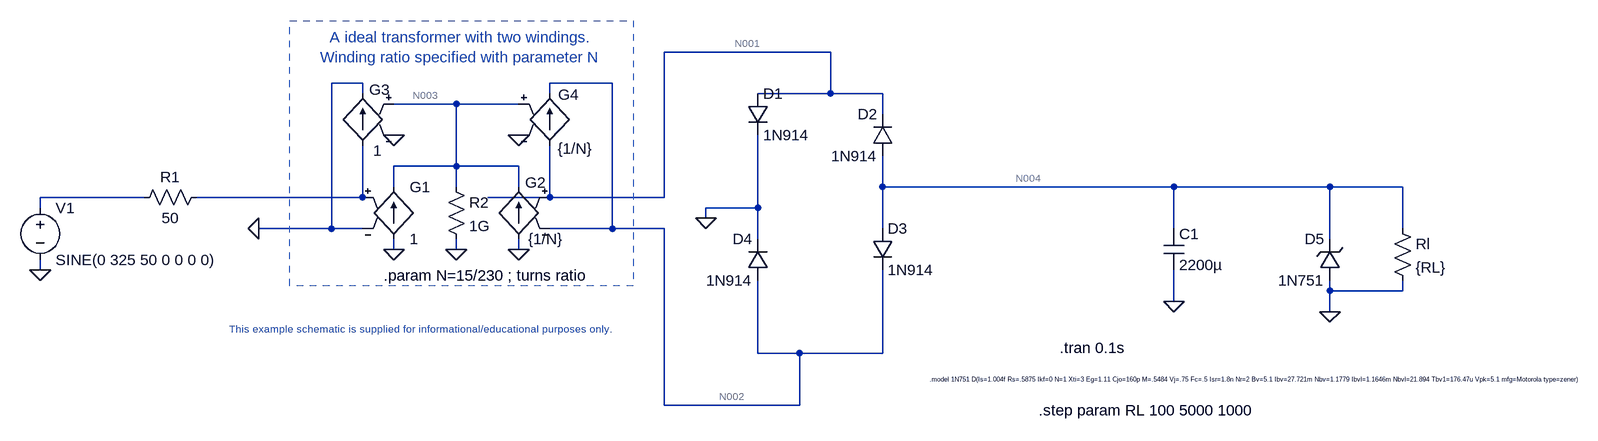
[diagram p0: schematic Voltage_Regulator_with_A_Shunt_capacitor.asc]
Voltage_Regulator_with_A_Shunt_capacitor.asc, the LTspice schematic file:
Version 4
SHEET 1 1868 680
WIRE 608 -192 352 -192
WIRE -112 -144 -160 -144
WIRE 272 -144 176 -144
WIRE -112 -128 -112 -144
WIRE 176 -128 176 -144
WIRE 608 -128 608 -192
WIRE 608 -128 496 -128
WIRE 688 -128 608 -128
WIRE 32 -112 -64 -112
WIRE 128 -112 32 -112
WIRE 688 -96 688 -128
WIRE 32 -16 32 -112
WIRE 32 -16 -64 -16
WIRE 128 -16 32 -16
WIRE -64 16 -64 -16
WIRE 32 16 32 -16
WIRE 128 16 128 -16
WIRE 688 16 688 -32
WIRE 1136 16 688 16
WIRE 1376 16 1136 16
WIRE 1488 16 1376 16
WIRE -448 32 -608 32
WIRE -112 32 -112 -48
WIRE -112 32 -368 32
WIRE 176 32 176 -48
WIRE 176 32 80 32
WIRE 352 32 352 -192
WIRE 352 32 176 32
WIRE -608 48 -608 32
WIRE 496 48 496 -64
WIRE 496 48 416 48
WIRE 416 64 416 48
WIRE -160 80 -160 -144
WIRE -160 80 -272 80
WIRE -112 80 -160 80
WIRE 272 80 272 -144
WIRE 272 80 176 80
WIRE 352 80 272 80
WIRE 688 80 688 16
WIRE 1136 80 1136 16
WIRE 1488 80 1488 16
WIRE 496 96 496 48
WIRE 1376 96 1376 16
WIRE -64 112 -64 96
WIRE 32 112 32 96
WIRE 128 112 128 96
WIRE -608 144 -608 128
WIRE 1376 176 1376 160
WIRE 1488 176 1488 160
WIRE 1488 176 1376 176
WIRE 1136 192 1136 144
WIRE 1376 208 1376 176
WIRE 496 272 496 160
WIRE 560 272 496 272
WIRE 688 272 688 144
WIRE 688 272 560 272
WIRE 352 352 352 80
WIRE 560 352 560 272
WIRE 560 352 352 352
FLAG -608 144 0
FLAG 128 112 0
FLAG -64 112 0
FLAG -64 -64 0
FLAG 128 -64 0
FLAG 32 112 0
FLAG -272 80 0
FLAG 416 64 0
FLAG 1136 192 0
FLAG 1376 208 0
SYMBOL voltage -608 32 R0
WINDOW 123 0 0 Left 0
WINDOW 39 0 0 Left 0
SYMATTR InstName V1
SYMATTR Value SINE(0 325 50 0 0 0 0)
SYMBOL res -352 16 R90
WINDOW 0 0 56 VBottom 2
WINDOW 3 32 56 VTop 2
SYMATTR InstName R1
SYMATTR Value 50
SYMBOL g -64 0 R0
SYMATTR InstName G1
SYMATTR Value 1
SYMBOL g 128 0 M0
WINDOW 0 -10 9 Right 2
WINDOW 3 -15 96 Right 2
SYMATTR InstName G2
SYMATTR Value {1/N}
SYMBOL g -112 -144 M0
WINDOW 0 -10 10 Right 2
WINDOW 3 -16 104 Right 2
SYMATTR InstName G3
SYMATTR Value 1
SYMBOL g 176 -144 R0
WINDOW 0 13 18 Left 2
WINDOW 3 12 101 Left 2
SYMATTR InstName G4
SYMATTR Value {1/N}
SYMBOL res 16 0 R0
SYMATTR InstName R2
SYMATTR Value 1G
SYMBOL diode 480 -128 R0
SYMATTR InstName D1
SYMATTR Value 1N914
SYMBOL diode 704 -32 R180
WINDOW 0 24 64 Left 2
WINDOW 3 24 0 Left 2
SYMATTR InstName D2
SYMATTR Value 1N914
SYMBOL diode 672 80 R0
SYMATTR InstName D3
SYMATTR Value 1N914
SYMBOL diode 512 160 R180
WINDOW 0 24 64 Left 2
WINDOW 3 24 0 Left 2
SYMATTR InstName D4
SYMATTR Value 1N914
SYMBOL cap 1120 80 R0
SYMATTR InstName C1
SYMATTR Value 2200µ
SYMBOL res 1472 64 R0
SYMATTR InstName Rl
SYMATTR Value {RL}
SYMBOL zener 1392 160 R180
WINDOW 0 24 64 Left 2
WINDOW 3 24 0 Left 2
SYMATTR InstName D5
SYMATTR Value 1N751
SYMATTR Description Diode
SYMATTR Type diode
TEXT -32 224 Top 1 ;This example schematic is supplied for informational/educational purposes only.
TEXT 40 -168 Bottom 2 ;A ideal transformer with two windings.\nWinding ratio specified with parameter N
TEXT -80 152 Left 2 !.param N=15/230 ; turns ratio
TEXT 960 264 Left 2 !.tran 0.1s
TEXT 760 312 Left 0 !.model 1N751 D(Is=1.004f Rs=.5875 Ikf=0 N=1 Xti=3 Eg=1.11 Cjo=160p M=.5484 Vj=.75 Fc=.5 Isr=1.8n Nr=2 Bv=5.1 Ibv=27.721m Nbv=1.1779 Ibvl=1.1646m Nbvl=21.894 Tbv1=176.47u Vpk=5.1 mfg=Motorola type=zener)
TEXT 928 360 Left 2 !.step param RL 100 5000 1000
RECTANGLE Normal 304 168 -224 -240 2

The netlist it stands for:
* Voltage_Regulator_with_A_Shunt_capacitor.asc
V1 N005 0 SINE(0 325 50 0 0 0 0)
R1 N006 N005 50
G1 0 N003 N006 0 1
G2 0 N003 N001 N002 {1/N}
G3 N006 0 N003 0 1
G4 N001 N002 N003 0 {1/N}
R2 N003 0 1G
D1 N001 0 1N914
D2 N004 N001 1N914
D3 N004 N002 1N914
D4 N002 0 1N914
C1 N004 0 2200µ
Rl N004 0 {RL}
D5 0 N004 1N751
.model D D
.lib standard.dio
* This example schematic is supplied for informational/educational purposes only.
* A ideal transformer with two windings.
* Winding ratio specified with parameter N
.param N=15/230 ; turns ratio
.tran 0.1s
.model 1N751 D(Is=1.004f Rs=.5875 Ikf=0 N=1 Xti=3 Eg=1.11 Cjo=160p M=.5484 Vj=.75 Fc=.5 Isr=1.8n Nr=2 Bv=5.1 Ibv=27.721m Nbv=1.1779 Ibvl=1.1646m Nbvl=21.894 Tbv1=176.47u Vpk=5.1 mfg=Motorola type=zener)
.step param RL 100 5000 1000
.backanno
.end

* Results of the author's LTspice run, read from the files saved beside the schematic
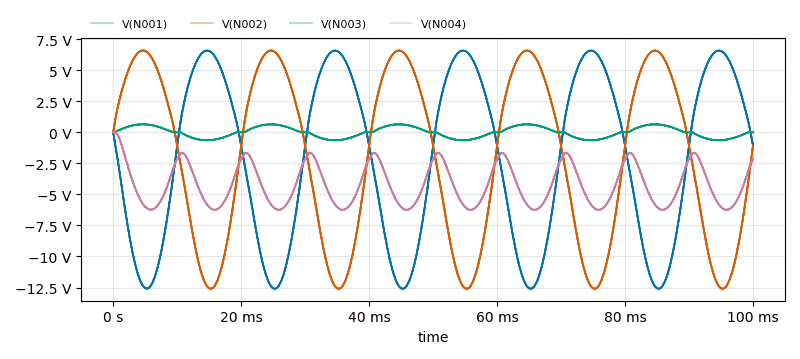
[diagram p1: Transient Analysis of Voltage_Regulator_with_A_Shunt_capacitor.asc, plotted from the saved traces]
* Transient Analysis, 6 runs:
*   V(N001) [rl=100]: min -12.59 V, max 6.591 V, average -2.092 V, rms 7.147 V, last -1.068 V
*   V(N001) [rl=1100]: min -12.6 V, max 6.583 V, average -2.1 V, rms 7.151 V, last -1.075 V
*   V(N001) [rl=2100]: min -12.6 V, max 6.583 V, average -2.1 V, rms 7.151 V, last -1.076 V
*   V(N001) [rl=3100]: min -12.6 V, max 6.582 V, average -2.1 V, rms 7.151 V, last -1.076 V
*   V(N001) [rl=4100]: min -12.6 V, max 6.582 V, average -2.1 V, rms 7.151 V, last -1.076 V
*   V(N001) [rl=5000]: min -12.6 V, max 6.582 V, average -2.1 V, rms 7.151 V, last -1.076 V
*   V(N002) [rl=100]: min -12.59 V, max 6.597 V, average -2.095 V, rms 7.159 V, last -1.068 V
*   V(N002) [rl=1100]: min -12.6 V, max 6.589 V, average -2.103 V, rms 7.163 V, last -1.075 V
*   V(N002) [rl=2100]: min -12.6 V, max 6.589 V, average -2.104 V, rms 7.163 V, last -1.076 V
*   V(N002) [rl=3100]: min -12.6 V, max 6.589 V, average -2.104 V, rms 7.163 V, last -1.076 V
*   V(N002) [rl=4100]: min -12.6 V, max 6.589 V, average -2.104 V, rms 7.163 V, last -1.076 V
*   V(N002) [rl=5000]: min -12.6 V, max 6.589 V, average -2.104 V, rms 7.163 V, last -1.076 V
*   V(N003) [rl=100]: min -641.8 mV, max 642.5 mV, average 913 µV, rms 432.7 mV, last 0 V
*   V(N003) [rl=1100]: min -641 mV, max 641.7 mV, average 922.7 µV, rms 432 mV, last 0 V
*   V(N003) [rl=2100]: min -640.9 mV, max 641.6 mV, average 921.3 µV, rms 432 mV, last 0 V
*   V(N003) [rl=3100]: min -640.9 mV, max 641.6 mV, average 920.8 µV, rms 432 mV, last 0 V
*   V(N003) [rl=4100]: min -640.9 mV, max 641.6 mV, average 922.5 µV, rms 431.9 mV, last 0 V
*   V(N003) [rl=5000]: min -640.9 mV, max 641.6 mV, average 921.4 µV, rms 431.9 mV, last 0 V
*   V(N004) [rl=100]: min -6.224 V, max 0 V, average -4.187 V, rms 4.493 V, last -2.135 V
*   V(N004) [rl=1100]: min -6.245 V, max 0 V, average -4.203 V, rms 4.51 V, last -2.15 V
*   V(N004) [rl=2100]: min -6.246 V, max 0 V, average -4.204 V, rms 4.51 V, last -2.151 V
*   V(N004) [rl=3100]: min -6.247 V, max 0 V, average -4.204 V, rms 4.511 V, last -2.151 V
*   V(N004) [rl=4100]: min -6.247 V, max 0 V, average -4.204 V, rms 4.511 V, last -2.152 V
*   V(N004) [rl=5000]: min -6.247 V, max 0 V, average -4.204 V, rms 4.511 V, last -2.152 V